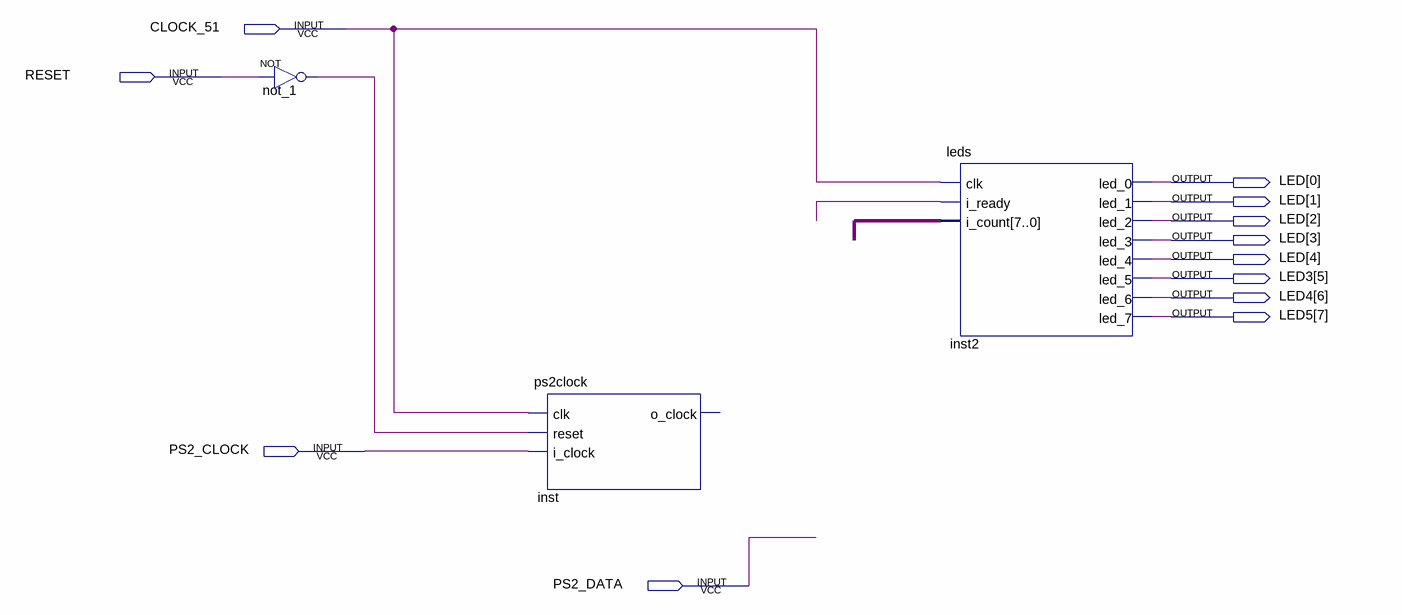
[diagram p0: schematic sheet]
// Quartus schematic keyboard_0.bdf as structural Verilog: 3 symbols, 12 pins
module keyboard_0 (
  input  CLOCK_51,
  input  RESET,
  input  PS2_CLOCK,
  input  PS2_DATA,
  output [4:0] LED,
  output [5:5] LED3,
  output [6:6] LED4,
  output [7:7] LED5
);

  wire not_1_out, undriven_2;
  wire [7:0] undriven;

  not not_1 (not_1_out, RESET);
  ps2clock inst (.clk(CLOCK_51), .reset(not_1_out), .i_clock(PS2_CLOCK));  // open: o_clock
  leds inst2 (
    .clk(CLOCK_51), .i_ready(undriven_2), .i_count(undriven), .led_0(LED[0]), .led_1(LED[1]), .led_2(LED[2]),
    .led_3(LED[3]), .led_4(LED[4]), .led_5(LED3[5]), .led_6(LED4[6]), .led_7(LED5[7]));
endmodule
